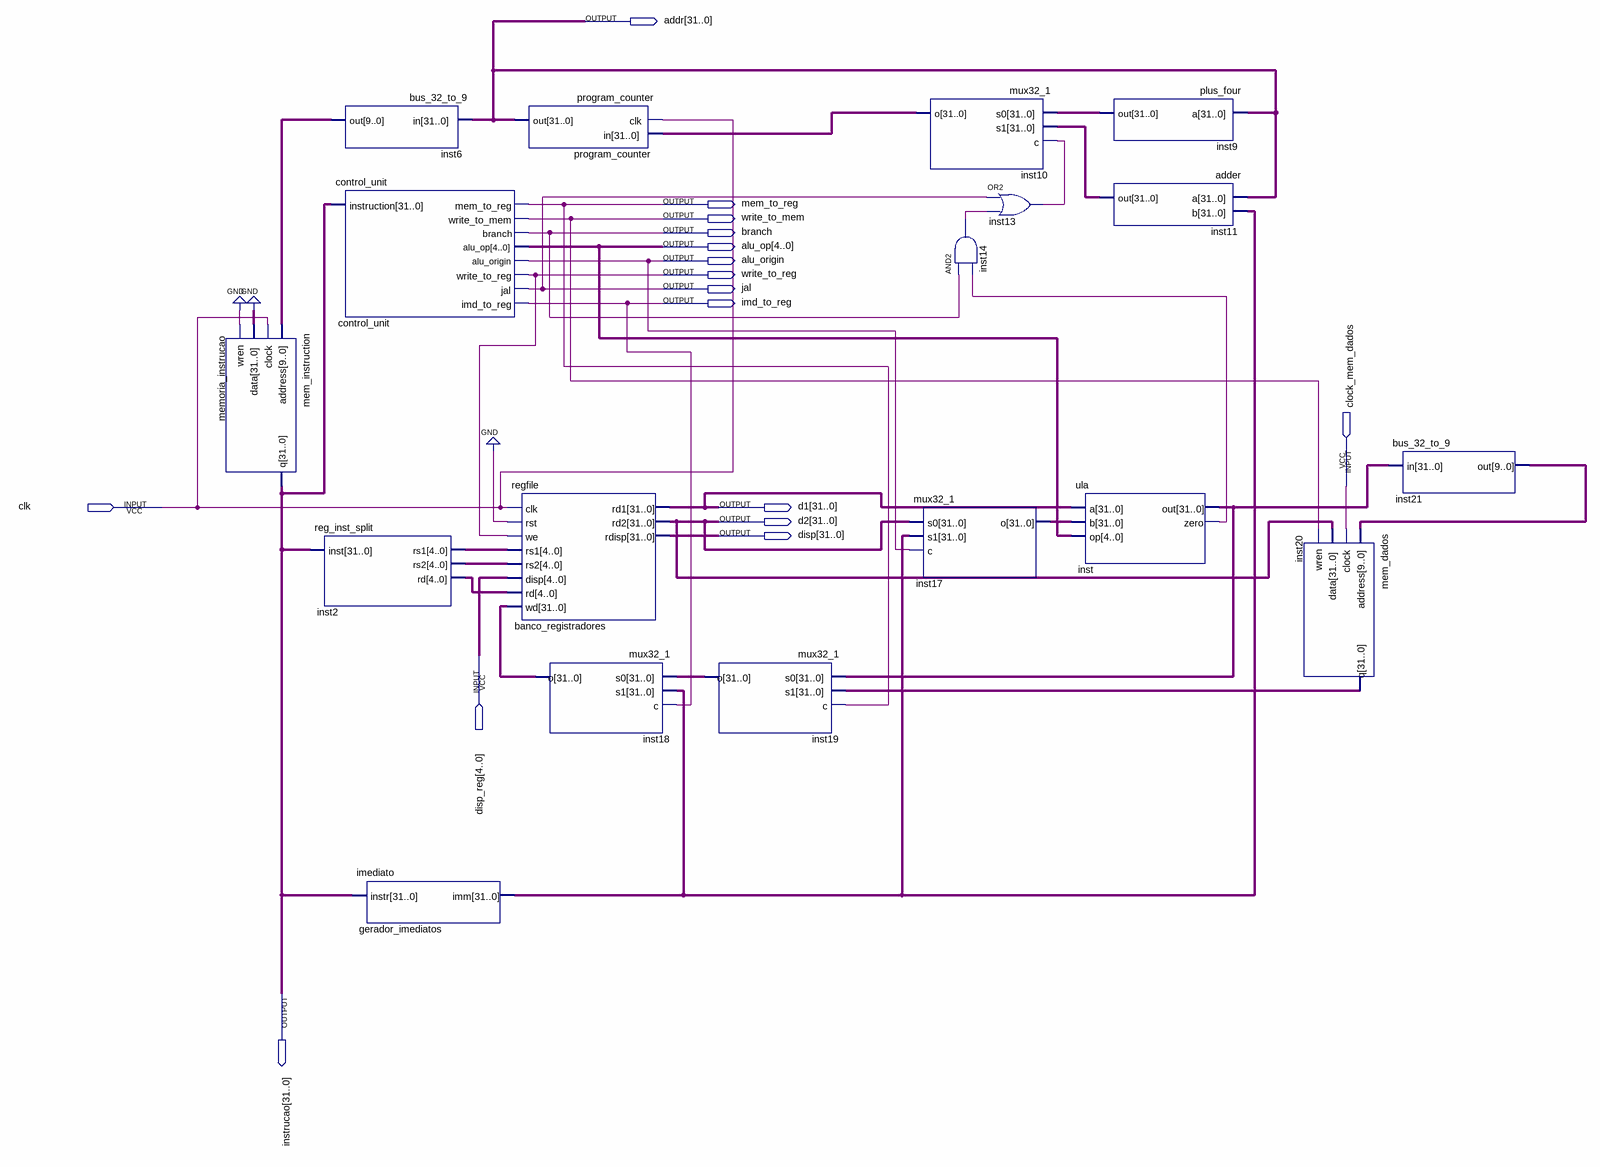
[diagram p0: schematic sheet]
// Quartus schematic uniciclo.bdf as structural Verilog: 18 symbols, 16 pins
module uniciclo (
  input  clock_mem_dados,
  input  clk,
  input  [4:0] disp_reg,
  output [31:0] addr,
  output mem_to_reg,
  output write_to_mem,
  output branch,
  output [4:0] alu_op,
  output alu_origin,
  output write_to_reg,
  output jal,
  output imd_to_reg,
  output [31:0] d1,
  output [31:0] d2,
  output [31:0] disp,
  output [31:0] instrucao
);

  wire inst13_out, inst14_out, inst_zero;
  wire [4:0] inst2_rd, inst2_rs1, inst2_rs2;
  wire [9:0] inst6_out, inst21_out;
  wire [31:0] gerador_imediatos_imm, inst9_out, inst10_o, inst11_out, inst17_o, inst18_o, inst19_o, inst20_q,
       inst_out;

  mem_instruction memoria_instrucao (.address(inst6_out), .clock(clk), .data({32{1'b0}}), .wren(1'b0), .q(instrucao));
  reg_inst_split inst2 (.inst(instrucao), .rs1(inst2_rs1), .rs2(inst2_rs2), .rd(inst2_rd));
  bus_32_to_9 inst6 (.in(addr), .out(inst6_out));
  control_unit control_unit (
    .instruction(instrucao), .mem_to_reg(mem_to_reg), .write_to_mem(write_to_mem), .branch(branch),
    .alu_op(alu_op), .alu_origin(alu_origin), .write_to_reg(write_to_reg), .jal(jal), .imd_to_reg(imd_to_reg));
  imediato gerador_imediatos (.instr(instrucao), .imm(gerador_imediatos_imm));
  program_counter program_counter (.clk(clk), .in(inst10_o), .out(addr));
  regfile banco_registradores (
    .clk(clk), .rst(1'b0), .we(write_to_reg), .rs1(inst2_rs1), .rs2(inst2_rs2), .disp(disp_reg),
    .rd(inst2_rd), .wd(inst18_o), .rd1(d1), .rd2(d2), .rdisp(disp));
  mux32_1 inst18 (.s0(inst19_o), .s1(gerador_imediatos_imm), .c(imd_to_reg), .o(inst18_o));
  mux32_1 inst19 (.s0(inst_out), .s1(inst20_q), .c(mem_to_reg), .o(inst19_o));
  mux32_1 inst10 (.s0(inst9_out), .s1(inst11_out), .c(inst13_out), .o(inst10_o));
  and inst14 (inst14_out, branch, inst_zero);
  mux32_1 inst17 (.s0(d2), .s1(gerador_imediatos_imm), .c(alu_origin), .o(inst17_o));
  or inst13 (inst13_out, jal, inst14_out);
  plus_four inst9 (.a(addr), .out(inst9_out));
  adder inst11 (.a(addr), .b(gerador_imediatos_imm), .out(inst11_out));
  ula inst (.a(d1), .b(inst17_o), .op(alu_op), .out(inst_out), .zero(inst_zero));
  mem_dados inst20 (.address(inst21_out), .clock(clock_mem_dados), .data(d2), .wren(write_to_mem), .q(inst20_q));
  bus_32_to_9 inst21 (.in(inst_out), .out(inst21_out));
endmodule
